# EAGLE design ics43432_pi (EAGLE 7.6.0)
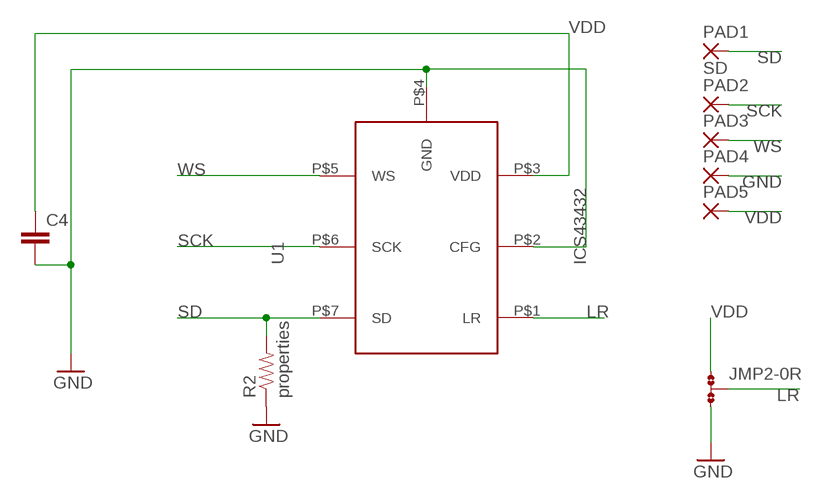
[diagram p0: schematic, sheet 1]

## Parts
C4  CAP0402-CAP  [0402-CAP]
JMP2  0R-JUMPC  [C0R-JMP]
PAD1  SD  SMD2  [SMD1,27-2,54]
PAD2  SMD2  [SMD1,27-2,54]
PAD3  SMD2  [SMD1,27-2,54]
PAD4  SMD2  [SMD1,27-2,54]
PAD5  SMD2  [SMD1,27-2,54]
R2  properties  RESISTOR0402-RES  [0402-RES]
U1  ICS43432  [ICS43432]

## Nets
GND: C4.2 JMP2.3 PAD4.1(P) R2.1 U1.P$2(CFG) U1.P$4(GND)
LR: JMP2.2 U1.P$1(LR)
SCK: PAD2.1(P) U1.P$6(SCK)
SD: PAD1.1(P) R2.2 U1.P$7(SD)
VDD: C4.1 JMP2.1 PAD5.1(P) U1.P$3(VDD)
WS: PAD3.1(P) U1.P$5(WS)

## Library data of the parts
C4 = SparkFun-Capacitors:CAP: Capacitor Standard 0603 ceramic capacitor, and 0.1" leaded capacitor.
JMP2 = jump-0r-smd:0R-JUMP: SMD 0R 0805 Jumper
PAD1-PAD5 = wirepad:SMD2: SMD PAD
R2 = SparkFun-Passives:RESISTOR: Resistor Basic schematic elements and footprints for 0603, 1206, and PTH resistors.
U1 = Kris:ICS43432

## Net classes
0 default: clearance 0.205 mm

## Board
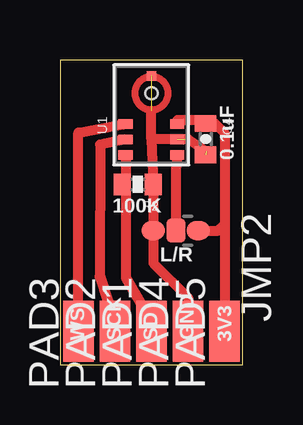
[diagram p1: board, top side]
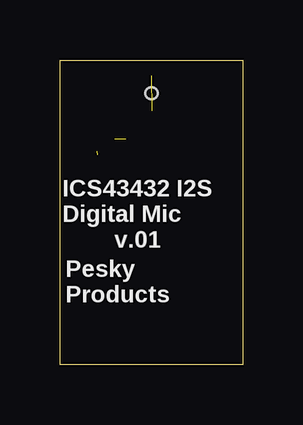
[diagram p2: board, bottom side, seen from below]

Size 7.62 x 12.7 mm. Coordinates in mm from the lower left corner, seen from the top.
Outline: 0,0 7.62,0 7.62,12.7 0,12.7 0,0
Copper layers (1*16): Top 0.0356mm / dielectric 1.5011mm / Bottom 0.0356mm
Design rules "OSHPark *": minimum track width 16mil, minimum drill 13mil, track to track 4mil, track to pad 4mil, pad to pad 6mil, via to via 6mil, smd to smd 6mil, copper to edge 10mil, drill to drill 6mil, minimum pad ring 7mil, minimum via ring 7mil, stop-mask expansion 3mil, vias tented up to drill 20mil, thermal gap 10mil

### Footprints (pad centres in the part's own frame; a part is rotated, then mirrored left to right if it is on the bottom)
0402-CAP = smd 0.7 x 0.9: 1 -0.65,0; 2 0.65,0
C0R-JMP = smd 0.8 x 1: 1 0,0.938; 3 0,-0.938 | smd 1 x 0.8: 2 0,0
SMD1,27-2,54 = smd 1.27 x 2.54: 1 0,0
0402-RES = smd 0.7 x 0.9: 1 -0.65,0; 2 0.65,0
ICS43432 = smd 0.4 x 0.6: P$1 -1.675,-1.075; P$2 -1.025,-1.075; P$3 -0.375,-1.075; P$5 -0.375,1.075; P$6 -1.025,1.075; P$7 -1.675,1.075 | smd 0.4 x 0.4: P$4 1.62,0 | hole 0.5: 0.9,0

### Placement (x,y rotation side)
C4  6.07,9.41 270 top
JMP2  4.83,5.59 270 top
PAD1  3.81,1.4 0 top
PAD2  2.29,1.4 0 top
PAD3  0.76,1.4 0 top
PAD4  5.33,1.4 0 top
PAD5  6.86,1.4 0 top
R2  3.24,7.52 180 top
U1  3.81,10.41 90 top

### Tracks (layer width: path | path; a pad name or v marks a point on that pad's centre or on a via)
GND  (3 unrouted)
  Top 0.406: 6.1,8.89 5.33,9.4 3.81,9.4 | 3.81,9.4 3.81,10.58 | 3.81,9.4 R2.1 JMP2.3 3.89,4.24 5.33,2.79 PAD4.1
LR
  Top 0.406: U1.P$1 4.83,8.13 JMP2.2
SCK
  Top 0.406: U1.P$6 1.68,9.17 1.65,3.68 2.29,1.78 PAD2.1
SD
  Top 0.406: U1.P$7 2.76,8.67 2.76,7.75 R2.2 2.76,7.45 2.76,3.62 3.82,1.79 PAD1.1
VDD
  Top 0.406: U1.P$3 4.9,10.2 5.81,10.2 C4.1 6.45,10.06 6.86,9.65 6.86,5.84 | 6.86,5.84 PAD5.1 | JMP2.1 6.6,5.59 6.86,5.84
WS
  Top 0.406: PAD3.1 0.76,9.68 U1.P$5

### Text on the board
tPlace: 0.1uF | 100K | L/R | WS | SCK | SD | GND | 3V3
bPlace: v.01 | ICS43432 I2S / Digital Mic | Pesky / Products